# Altium schematic sheet mc33775.SchDoc
size A3; DocumentNumber: 2; SheetNumber: 2; SheetTotal: 11; SheetDescription: MC33775A BMS IC
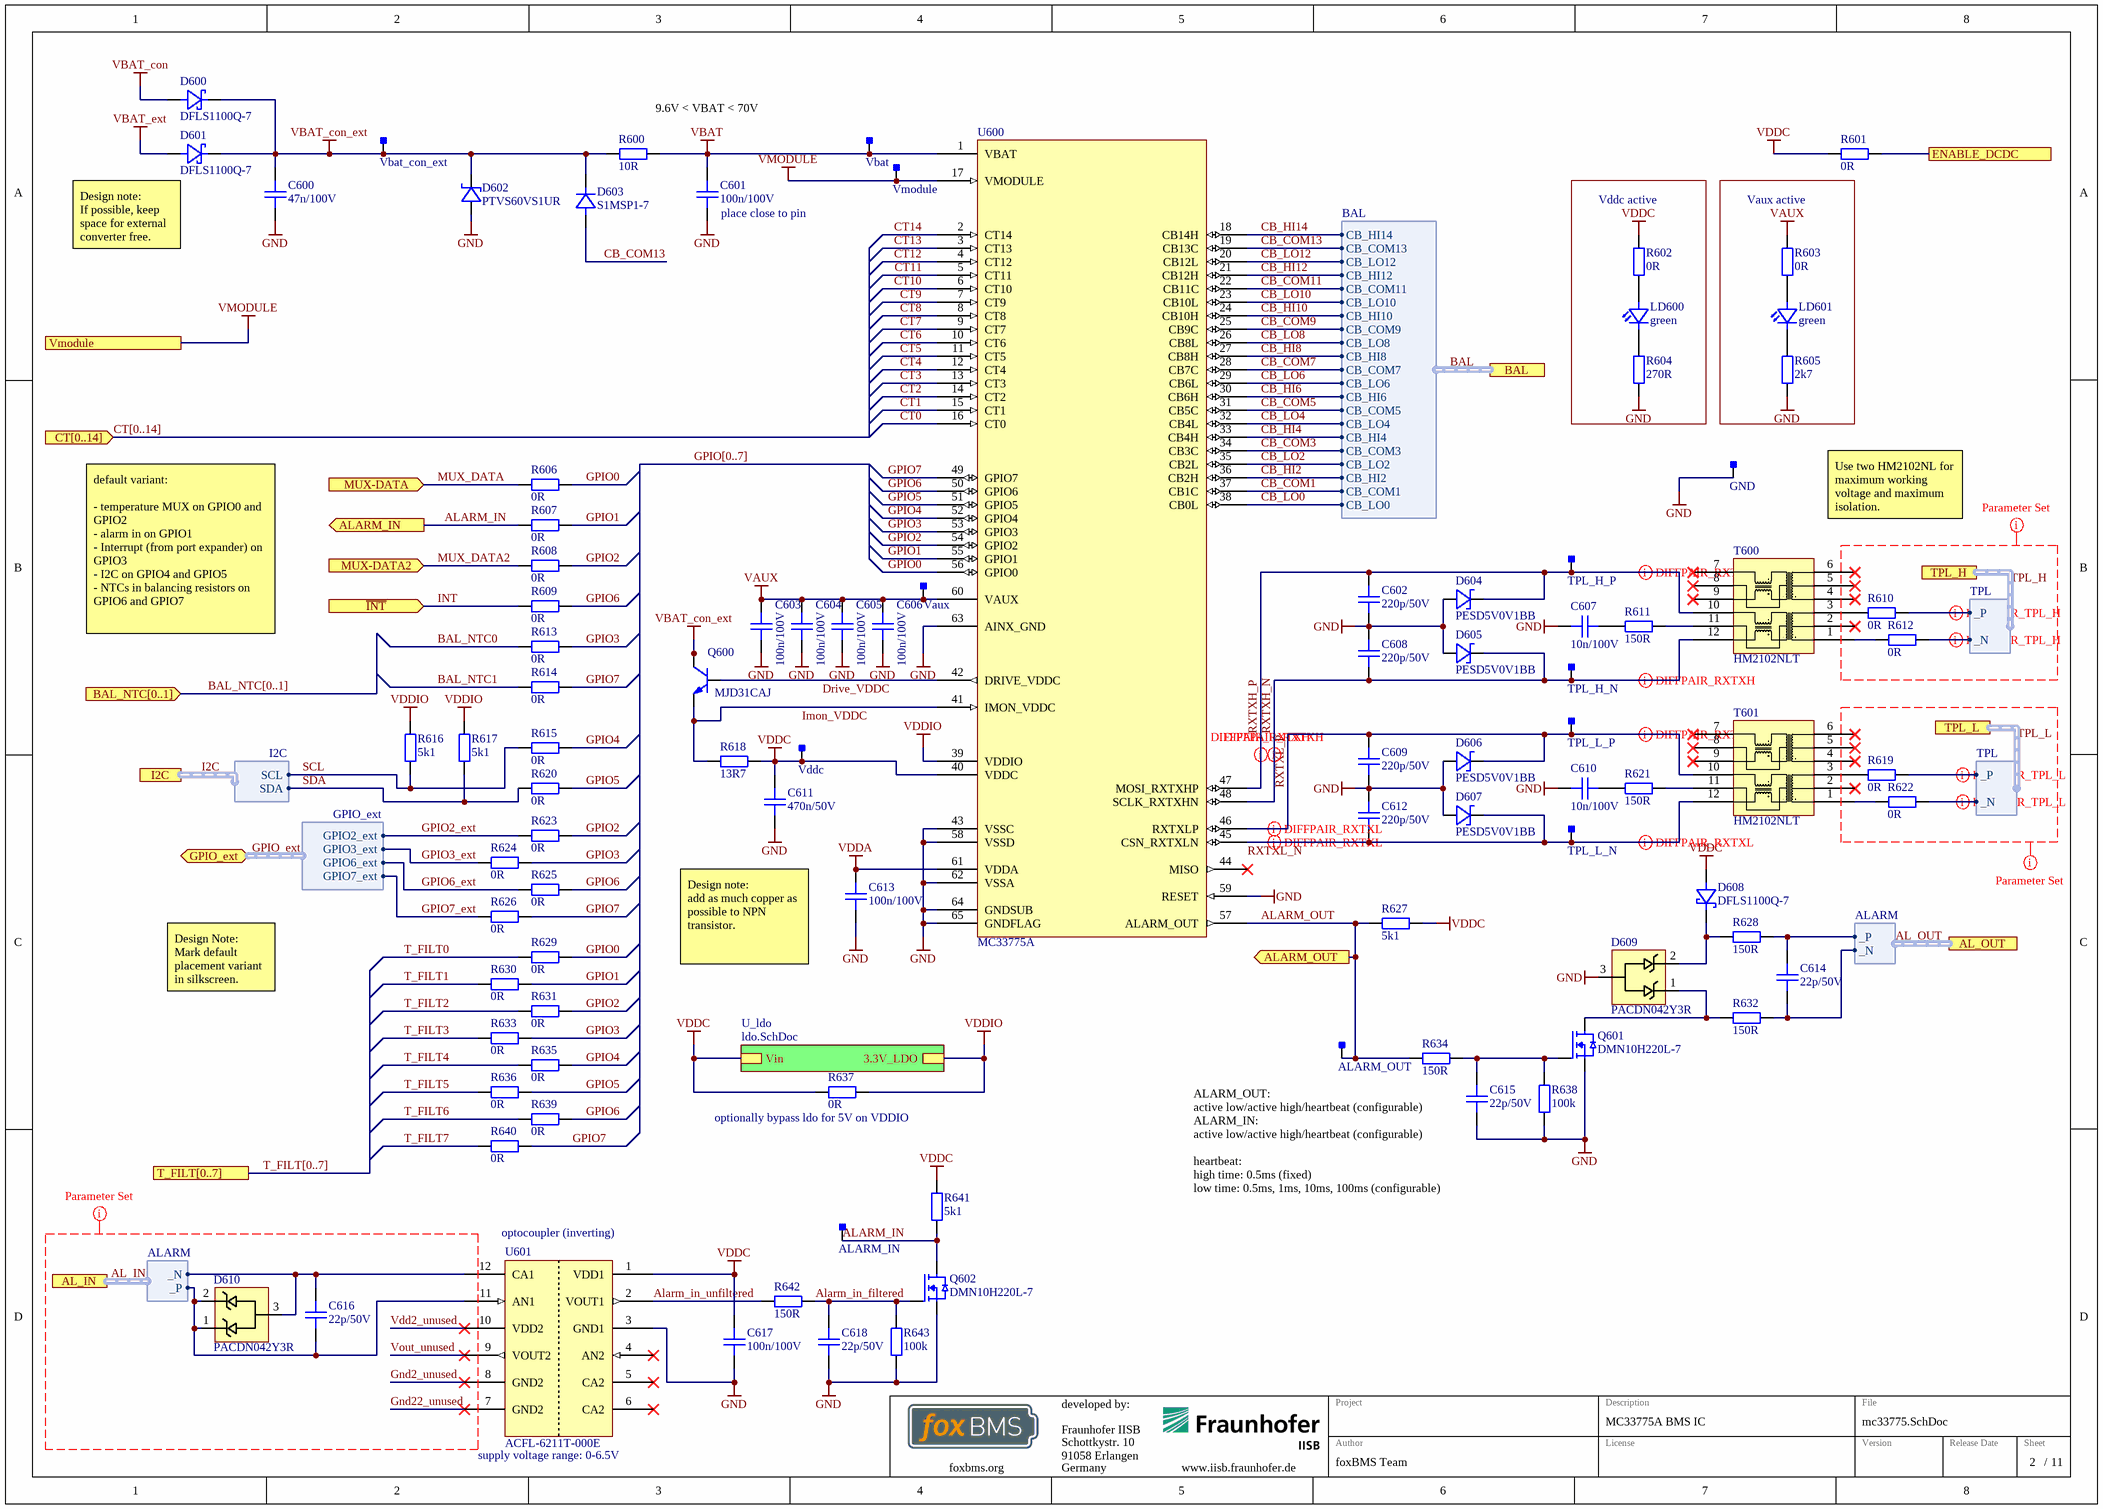
[diagram p0: mc33775.SchDoc]

## Parts
ALARM_IN  Testpoint_Square  [Testpoint_S1]  (value not drawn)  (no BOM)
ALARM_OUT  Testpoint_Square  [Testpoint_S1]  (value not drawn)  (no BOM)
C600  47n/100V  [CAPC1608X08N]
C601  100n/100V  [CAPC1608X08N]
C602  220p/50V  [CAPC1608X08N]
C603  100n/100V  [CAPC1608X08N]
C604  100n/100V  [CAPC1608X08N]
C605  100n/100V  [CAPC1608X08N]
C606  100n/100V  [CAPC1608X08N]
C607  10n/100V  [CAPC1608X08N]
C608  220p/50V  [CAPC1608X08N]
C609  220p/50V  [CAPC1608X08N]
C610  10n/100V  [CAPC1608X08N]
C611  470n/50V  [CAPC1608X08N]
C612  220p/50V  [CAPC1608X08N]
C613  100n/100V  [CAPC1608X08N]
C614  22p/50V  [CAPC1005X06N]
C615  22p/50V  [CAPC1005X06N]
C616  22p/50V  [CAPC1005X06N]
C617  100n/100V  [CAPC1608X08N]
C618  22p/50V  [CAPC1005X06N]
D600  DFLS1100Q-7  [PowerDI123]
D601  DFLS1100Q-7  [PowerDI123]
D602  PTVS60VS1UR  [NEXPERIA_PTVSxS1UR]
D603  S1MSP1-7  [S1MSP1]
D604  PESD5V0V1BB  [SOD523_PESD_NEXPERIA]
D605  PESD5V0V1BB  [SOD523_PESD_NEXPERIA]
D606  PESD5V0V1BB  [SOD523_PESD_NEXPERIA]
D607  PESD5V0V1BB  [SOD523_PESD_NEXPERIA]
D608  DFLS1100Q-7  [PowerDI123]
D609  PACDN042Y3R  [ON-SEMI-SOT-23-3-CASE-318-08]
D610  PACDN042Y3R  [ON-SEMI-SOT-23-3-CASE-318-08]
GND  Testpoint_Square  [Testpoint_S1]  (value not drawn)  (no BOM)
LD600  green  [LEDC1608X07N]
LD601  green  [LEDC1608X07N]
Q600  MJD31CAJ  [NEXPERIA_DPAK_SOT428C]
Q601  DMN10H220L-7  [SOT95P237X110-3N]
Q602  DMN10H220L-7  [SOT95P237X110-3N]
R600  10R  [RESC2012X05N]
R601  0R  [RESC1608X05N]
R602  0R  [RESC1608X05N]
R603  0R  [RESC1608X05N]
R604  270R  [RESC1608X05N]
R605  2k7  [RESC1608X05N]
R606  0R  [RESC1608X05N]
R607  0R  [RESC1608X05N]
R608  0R  [RESC1608X05N]
R609  0R  [RESC1608X05N]
R610  0R  [RESC1608X05N]
R611  150R  [RESC1608X05N]
R612  0R  [RESC1608X05N]
R613  0R  [RESC1608X05N]
R614  0R  [RESC1608X05N]
R615  0R  [RESC1608X05N]
R616  5k1  [RESC1608X05N]
R617  5k1  [RESC1608X05N]
R618  13R7  [RESC1608X05N]
R619  0R  [RESC1608X05N]
R620  0R  [RESC1608X05N]
R621  150R  [RESC1608X05N]
R622  0R  [RESC1608X05N]
R623  0R  [RESC1608X05N]
R624  0R  [RESC1608X05N]
R625  0R  [RESC1608X05N]
R626  0R  [RESC1608X05N]
R627  5k1  [RESC1608X05N]
R628  150R  [RESC1608X05N]
R629  0R  [RESC1608X05N]
R630  0R  [RESC1608X05N]
R631  0R  [RESC1608X05N]
R632  150R  [RESC1608X05N]
R633  0R  [RESC1608X05N]
R634  150R  [RESC1608X05N]
R635  0R  [RESC1608X05N]
R636  0R  [RESC1608X05N]
R637  0R  [RESC1608X05N]
R638  100k  [RESC1608X05N]
R639  0R  [RESC1608X05N]
R640  0R  [RESC1608X05N]
R641  5k1  [RESC1608X05N]
R642  150R  [RESC1608X05N]
R643  100k  [RESC1608X05N]
T600  HM2102NLT  [HM2102NL]
T601  HM2102NLT  [HM2102NL]
TPL_H_N  Testpoint_Square  [Testpoint_S1]  (value not drawn)  (no BOM)
TPL_H_P  Testpoint_Square  [Testpoint_S1]  (value not drawn)  (no BOM)
TPL_L_N  Testpoint_Square  [Testpoint_S1]  (value not drawn)  (no BOM)
TPL_L_P  Testpoint_Square  [Testpoint_S1]  (value not drawn)  (no BOM)
U600  MC33775A  [NXP_SOT1510-2]
U601  ACFL-6211T-000E  [Broadcom_ACFL-6211T]
Vaux  Testpoint_Square  [Testpoint_S1]  (value not drawn)  (no BOM)
Vbat  Testpoint_Square  [Testpoint_S1]  (value not drawn)  (no BOM)
Vbat_con_ext  Testpoint_Square  [Testpoint_S1]  (value not drawn)  (no BOM)
Vddc  Testpoint_Square  [Testpoint_S1]  (value not drawn)  (no BOM)
Vmodule  Testpoint_Square  [Testpoint_S1]  (value not drawn)  (no BOM)

## Blocks framed on the sheet
Vddc active: LD600 R602 R604
Vaux active: LD601 R603 R605

## Sub-sheets
U_ldo = ldo.SchDoc: 3.3V_LDO, Vin

## Ports
AL_IN (harness ALARM), AL_OUT (harness ALARM), ALARM_IN (out), ALARM_OUT (out), BAL (harness BAL), BAL_NTC[0..1] (in), CT[0..14] (in), ENABLE_DCDC, GPIO_ext (bidir, harness GPIO_ext), I2C (harness I2C), MUX-DATA2 (in), MUX-DATA (in), T_FILT[0..7], TPL_H (harness TPL), TPL_L (harness TPL), Vmodule, ~{INT} (in)

## Harnesses
BAL: CB_HI14, CB_COM13, CB_LO12, CB_HI12, CB_COM11, CB_LO10, CB_HI10, CB_COM9, CB_LO8, CB_HI8, CB_COM7, CB_LO6, CB_HI6, CB_COM5, CB_LO4, CB_HI4, CB_COM3, CB_LO2, CB_HI2, CB_COM1, CB_LO0
TPL: _P, _N
ALARM: _P, _N
I2C: SCL, SDA
GPIO_ext: GPIO3_ext, GPIO2_ext, GPIO6_ext, GPIO7_ext

## Nets
GND: C600.1 C601.1 C602.1 C603.1 C604.1 C605.1 C606.1 C607.1 C608.2 C609.1 C610.1 C611.1 C612.2 C613.1 C615.1 C617.1 C618.1 D602.2(A) D604.2(A) D605.2(A) D606.2(A) D607.2(A) D609.3 GND.1 Q601.S Q602.S R604.1 R605.1 R638.2 R643.2 U600.43(VSSC) U600.58(VSSD) U600.59(RESET) U600.62(VSSA) U600.63(AINX_GND) U600.64(GNDSUB) U600.65(GNDFLAG) U601.3(GND1)
VAUX: C603.2 C604.2 C605.2 C606.2 R603.2 U600.60(VAUX) Vaux.1
VBAT: C601.2 R600.1 U600.1(VBAT) Vbat.1
VBAT_con: D600.2(A)
VBAT_con_ext: C600.2 D600.1(K) D601.1(K) D602.1(C) D603.1(K) Q600.2(C) Q600.4(C) R600.2 Vbat_con_ext.1
VBAT_ext: D601.2(A)
VDDA: C613.2 U600.61(VDDA)
VDDC: C611.2 C617.2 D608.2(A) R601.1 R602.2 R618.1 R627.1 R637.2 R641.1 U600.40(VDDC) U601.1(VDD1) Vddc.1 ; sheet U_ldo/Vin
VDDIO: R616.2 R617.2 R637.1 U600.39(VDDIO) ; sheet U_ldo/3.3V_LDO
VMODULE: U600.17(VMODULE) Vmodule.1 ; port Vmodule
AL_IN._N: C616.2 D610.3 U601.12(CA1) ; port AL_IN._N
AL_IN._P: C616.1 D610.1 D610.2 U601.11(AN1) ; port AL_IN._P
AL_OUT._N: C614.1 R632.2 ; port AL_OUT._N
AL_OUT._P: C614.2 R628.2 ; port AL_OUT._P
ALARM_IN: ALARM_IN.1 Q602.D R607.1 R641.2 ; port ALARM_IN
Alarm_in_filtered: C618.2 Q602.G R642.2 R643.1
Alarm_in_unfiltered: R642.1 U601.2(VOUT1)
ALARM_OUT: ALARM_OUT.1 R627.2 R634.1 U600.57(ALARM_OUT) ; port ALARM_OUT
BAL_NTC0: R613.1
BAL_NTC1: R614.1
CB_COM1: U600.37(CB1C) ; port BAL.CB_COM1  [project net BAL.CB_COM1]
CB_COM3: U600.34(CB3C) ; port BAL.CB_COM3  [project net BAL.CB_COM3]
CB_COM5: U600.31(CB5C) ; port BAL.CB_COM5  [project net BAL.CB_COM5]
CB_COM7: U600.28(CB7C) ; port BAL.CB_COM7  [project net BAL.CB_COM7]
CB_COM9: U600.25(CB9C) ; port BAL.CB_COM9  [project net BAL.CB_COM9]
CB_COM11: U600.22(CB11C) ; port BAL.CB_COM11  [project net BAL.CB_COM11]
CB_COM13: D603.2(A) U600.19(CB13C) ; port BAL.CB_COM13  [project net BAL.CB_COM13]
CB_HI2: U600.36(CB2H) ; port BAL.CB_HI2  [project net BAL.CB_HI2]
CB_HI4: U600.33(CB4H) ; port BAL.CB_HI4  [project net BAL.CB_HI4]
CB_HI6: U600.30(CB6H) ; port BAL.CB_HI6  [project net BAL.CB_HI6]
CB_HI8: U600.27(CB8H) ; port BAL.CB_HI8  [project net BAL.CB_HI8]
CB_HI10: U600.24(CB10H) ; port BAL.CB_HI10  [project net BAL.CB_HI10]
CB_HI12: U600.21(CB12H) ; port BAL.CB_HI12  [project net BAL.CB_HI12]
CB_HI14: U600.18(CB14H) ; port BAL.CB_HI14  [project net BAL.CB_HI14]
CB_LO0: U600.38(CB0L) ; port BAL.CB_LO0  [project net BAL.CB_LO0]
CB_LO2: U600.35(CB2L) ; port BAL.CB_LO2  [project net BAL.CB_LO2]
CB_LO4: U600.32(CB4L) ; port BAL.CB_LO4  [project net BAL.CB_LO4]
CB_LO6: U600.29(CB6L) ; port BAL.CB_LO6  [project net BAL.CB_LO6]
CB_LO8: U600.26(CB8L) ; port BAL.CB_LO8  [project net BAL.CB_LO8]
CB_LO10: U600.23(CB10L) ; port BAL.CB_LO10  [project net BAL.CB_LO10]
CB_LO12: U600.20(CB12L) ; port BAL.CB_LO12  [project net BAL.CB_LO12]
CT0: U600.16(CT0)
CT1: U600.15(CT1)
CT2: U600.14(CT2)
CT3: U600.13(CT3)
CT4: U600.12(CT4)
CT5: U600.11(CT5)
CT6: U600.10(CT6)
CT7: U600.9(CT7)
CT8: U600.8(CT8)
CT9: U600.7(CT9)
CT10: U600.6(CT10)
CT11: U600.5(CT11)
CT12: U600.4(CT12)
CT13: U600.3(CT13)
CT14: U600.2(CT14)
Drive_VDDC: Q600.1(B) U600.42(DRIVE_VDDC)
ENABLE_DCDC: R601.2 ; port ENABLE_DCDC
Gnd2_unused: U601.8(GND2)
Gnd22_unused: U601.7(GND2)
GPIO0: R606.2 R629.2 U600.56(GPIO0)
GPIO1: R607.2 R630.2 U600.55(GPIO1)
GPIO2: R608.2 R623.2 R631.2 U600.54(GPIO2)
GPIO2_ext: R623.1 ; port GPIO_ext.GPIO2_ext
GPIO3: R613.2 R624.2 R633.2 U600.53(GPIO3)
GPIO3_ext: R624.1 ; port GPIO_ext.GPIO3_ext
GPIO4: R615.2 R635.2 U600.52(GPIO4)
GPIO5: R620.2 R636.2 U600.51(GPIO5)
GPIO6: R609.2 R625.2 R639.2 U600.50(GPIO6)
GPIO6_ext: R625.1 ; port GPIO_ext.GPIO6_ext
GPIO7: R614.2 R626.2 R640.2 U600.49(GPIO7)
GPIO7_ext: R626.1 ; port GPIO_ext.GPIO7_ext
Imon_VDDC: Q600.3(E) R618.2 U600.41(IMON_VDDC)
INT: R609.1 ; port ~{INT}
MUX_DATA: R606.1 ; port MUX-DATA
MUX_DATA2: R608.1 ; port MUX-DATA2
RXTXH_N: C608.1 D605.1(C) T600.12 TPL_H_N.1 U600.48(SCLK_RXTXHN)
RXTXH_P: C602.2 D604.1(C) T600.10 TPL_H_P.1 U600.47(MOSI_RXTXHP)
RXTXL_N: C612.1 D607.1(C) T601.12 TPL_L_N.1 U600.45(CSN_RXTXLN)
RXTXL_P: C609.2 D606.1(C) T601.10 TPL_L_P.1 U600.46(RXTXLP)
SCL: R615.1 R616.1 ; port I2C.SCL  [project net I2C.SCL]
SDA: R617.1 R620.1 ; port I2C.SDA  [project net I2C.SDA]
T_FILT0: R629.1
T_FILT1: R630.1
T_FILT2: R631.1
T_FILT3: R633.1
T_FILT4: R635.1
T_FILT5: R636.1
T_FILT6: R639.1
T_FILT7: R640.1
TPL_H._N: R612.2 ; port TPL_H._N
TPL_H._P: R610.2 ; port TPL_H._P
TPL_L._N: R622.2 ; port TPL_L._N
TPL_L._P: R619.2 ; port TPL_L._P
Vdd2_unused: U601.10(VDD2)
Vout_unused: U601.9(VOUT2)
NetC607_2: C607.2 R611.1
NetC610_2: C610.2 R621.1
NetC615_2: C615.2 Q601.G R634.2 R638.1
NetD608_1: D608.1(K) D609.2 R628.1
NetD609_1: D609.1 Q601.D R632.1
NetLD600_1: LD600.1(C) R604.2
NetLD600_2: LD600.2(A) R602.1
NetLD601_1: LD601.1(C) R605.2
NetLD601_2: LD601.2(A) R603.1
NetR610_1: R610.1 T600.3
NetR611_2: R611.2 T600.11
NetR612_1: R612.1 T600.1
NetR619_1: R619.1 T601.3
NetR621_2: R621.2 T601.11
NetR622_1: R622.1 T601.1

Not connected (* = marked no-connect by the designer): T600 2* 4* 5* 6* 7* 8* 9*; T601 2* 4* 5* 6* 7* 8* 9*; U600 44(MISO)*; U601 4(AN2)* 5(CA2)* 6(CA2)*

## Buses and harness runs
bus BAL_NTC[0..1] = port BAL_NTC[0..1]
bus CT[0..14] = port CT[0..14]
bus GPIO[0..7]
bus T_FILT[0..7] = port T_FILT[0..7]
harness AL_IN = port AL_IN
harness AL_OUT = port AL_OUT
harness BAL = port BAL
harness GPIO_ext = port GPIO_ext
harness I2C = port I2C
harness TPL_H = port TPL_H
harness TPL_L = port TPL_L

## Layout directives
differential pair: RXTXH_N, RXTXH_P, RXTXL_N, RXTXL_P, TPL_L._N, TPL_L._P
differential pair; differential pair class TPL_H: TPL_H._N, TPL_H._P
net class TPL_high: TPL_H
net class TPL_low: TPL_L
net class ALARM_in: AL_IN, Gnd2_unused, Gnd22_unused, Vdd2_unused, Vout_unused

## Notes on the sheet
- (near R600) 9.6V < VBAT < 70V
- (near D601) Design note:
  If possible, keep space for external converter free.
- (near C601) place close to pin
- Use two HM2102NL for maximum working voltage and maximum isolation.
- default variant:
  - temperature MUX on GPIO0 and GPIO2
  - alarm in on GPIO1
  - Interrupt (from port expander) on GPIO3
  - I2C on GPIO4 and GPIO5
  - NTCs in balancing resistors on GPIO6 and GPIO7
- Design Note:
  Mark default placement variant in silkscreen.
- Design note:
  add as much copper as possible to NPN transistor.
- (near R637) optionally bypass ldo for 5V on VDDIO
- ALARM_OUT:
  active low/active high/heartbeat (configurable)
  ALARM_IN:
  active low/active high/heartbeat (configurable)
  heartbeat:
  high time: 0.5ms (fixed)
  low time: 0.5ms, 1ms, 10ms, 100ms (configurable)
- (near U601) optocoupler (inverting)
- (near U601) supply voltage range: 0-6.5V
- Fraunhofer IISB
- Schottkystr. 10
- developed by:
- 91058 Erlangen
- Germany
- Author
- Project
- License
- Description
- File
- Version
- Release Date
- Sheet
- foxbms.org <https://foxbms.org>
- www.iisb.fraunhofer.de <https://www.iisb.fraunhofer.de/>
- foxBMS Team
- /

## Library data of the parts
ALARM_IN ALARM_OUT GND TPL_H_N TPL_H_P TPL_L_N TPL_L_P Vaux Vbat Vbat_con_ext Vddc Vmodule = Testpoint_Square: Testpoint, square; Automotive Qualified: False; Part Number: Testpoint_Square
C600 = gen_C_ceramic_47n_100V_X7R_0603: MLCC; Capacitance: 47n; Rated Voltage: 100V; Dielectric: X7R; Case EIA: 0603; Case Metric: 1608; Automotive Qualified: True; PnP Package: 0603C; Part Number: gen_C_ceramic_47n_100V_X7R_0603; Supplier 1: Farnell; Supplier Part Number 1: 2478249; Supplier 2: Farnell; Supplier Part Number 2: 2708699; Supplier 3: Farnell; Supplier Part Number 3: 2905110
C601 C603-C606 C613 C617 = gen_C_ceramic_100n_100V_X7R_0603: MLCC; Capacitance: 100n; Rated Voltage: 100V; Dielectric: X7R; Case EIA: 0603; Case Metric: 1608; Automotive Qualified: True; PnP Package: 0603C; Part Number: gen_C_ceramic_100n_100V_X7R_0603; Supplier 1: Digikey; Supplier Part Number 1: 490-13420-1-ND; Supplier 2: Mouser; Supplier Part Number 2: 81-GCJ188R72A104KA1D
C602 C608 C609 C612 = gen_C_ceramic_220p_50V_C0G_0603: MLCC; Capacitance: 220p; Rated Voltage: 50V; Dielectric: C0G; Case EIA: 0603; Case Metric: 1608; Automotive Qualified: True; AEC-Q Norm: AEC-Q200; PnP Package: 0603C; Part Number: gen_C_ceramic_220p_50V_C0G_0603; Supplier 1: Mouser; Supplier Part Number 1: 603-AC603JRNPO9BN221; ECCN: EAR99
C607 C610 = gen_C_ceramic_10n_100V_X7R_0603: MLCC; Capacitance: 10n; Rated Voltage: 100V; Dielectric: X7R; Case EIA: 0603; Case Metric: 1608; PnP Package: 0603C; PnP Value: 10nF/100V/X7R; Automotive Qualified: True; AEC-Q Norm: AEC-Q200; Part Number: gen_C_ceramic_10n_100V_X7R_0603; Supplier 1: Farnell; Supplier Part Number 1: 1301715; Supplier 2: Farnell; Supplier Part Number 2: 2821192; Supplier 3: Farnell; Supplier Part Number 3: 2210878; ECCN: EAR99
C611 = gen_C_ceramic_470n_50V_X7R_0603: MLCC; Capacitance: 470n; Rated Voltage: 50V; Dielectric: X7R; Case EIA: 0603; Case Metric: 1608; Automotive Qualified: True; AEC-Q Norm: AEC-Q200; PnP Package: 0603C; Part Number: gen_C_ceramic_470n_50V_X7R_0603; Supplier 1: Farnell; Supplier Part Number 1: 2547051; ECCN: EAR99
C614-C616 C618 = gen_C_ceramic_22p_50V_C0G_0402: MLCC; Capacitance: 22p; Rated Voltage: 50V; Dielectric: C0G; Case EIA: 0402; Case Metric: 1005; PnP Package: 0402C; Automotive Qualified: True; Tolerance: 1%; Part Number: gen_C_ceramic_22p_50V_C0G_0402; Supplier 1: Farnell; Supplier Part Number 1: 1856067
D600 D601 D608 = DFLS1100Q-7: Schottky Diode; Manufacturer: Diodes Inc.; Breakdown Voltage: 100V; Continuous Forward Current: 1A; Automotive Qualified: True; Part Number: DFLS1100Q-7; Part Name: DFLS1100Q-7; Operating Temperature: −55°C - +175°C; ComponentLink1Description: Datasheet; ComponentLink1URL: https://www.diodes.com/assets/Datasheets/ds30497.pdf; Supplier 1: Mouser; Supplier Part Number 1: 621-DFLS1-100Q-7; Supplier 2: Digikey; Supplier Part Number 2: DFLS1100Q-7DICT-ND; Supplier 3: Farnell; Supplier Part Number 3: 3127293; PnP Package: POWERDI123
D602 = PTVS60VS1UR: 400W Transient Voltage Suppressor; Part Name: PTVSxS1UR; Manufacturer: Nexperia; Breakdown Voltage: 70.20V; Automotive Qualified: True; AEC-Q Norm: AEC-Q101; Part Number: PTVS60VS1UR; Operating Temperature: -55°C - +150°C; Continuous Forward Current: *; ComponentLink1Description: Datasheet; ComponentLink1URL: https://assets.nexperia.com/documents/data-sheet/PTVSXS1UR_SER.pdf; Supplier 1: Mouser; Supplier Part Number 1: 771-PTVS60VS1UR115; Supplier 2: Digikey; Supplier Part Number 2: 1727-5879-1-ND; ECCN: EAR99
D603 = S1MSP1-7: 1.0A surface mount glass passivated rectifier; Manufacturer: Diodes Inc.; Breakdown Voltage: 1000V; Continuous Forward Current: 1A; Automotive Qualified: False; Part Number: S1MSP1-7; Part Name: S1MSP1-7; Operating Temperature: -55°C - +150°C; ComponentLink1Description: Datasheet; ComponentLink1URL: https://www.mouser.de/datasheet/2/115/S1MSP1-1019698.pdf; Supplier 1: Mouser; Supplier Part Number 1: 621-S1MSP1-7; Supplier 2: Digikey; Supplier Part Number 2: S1MSP1-7-ND; ECCN: EAR99
D604-D607 = PESD5V0V1BB: Very low capacitance bidirectional ESD protection diode; Manufacturer: Nexperia; Breakdown Voltage: 6.8V; PnP Package: SOD523; Automotive Qualified: True; AEC-Q Norm: AEC-Q101; Part Number: PESD5V0V1BB; Part Name: PESD5V0V1BB; Operating Temperature: -55°C - +150°C; Continuous Forward Current: *; ComponentLink1Description: Datasheet; ComponentLink1URL: https://assets.nexperia.com/documents/data-sheet/PESD5V0V1BB.pdf; Supplier 1: Mouser; Supplier Part Number 1: 771-PESD5V0V1BB115; Supplier 2: Digikey; Supplier Part Number 2: 1727-5808-1-ND; Supplier 3: Farnell; Supplier Part Number 3: 2069367; ECCN: EAR99
D609 D610 = PACDN042Y3R: ESD-Schutzbaustein; Manufacturer: ON Semiconductor; Breakdown Voltage: 8V; PnP Package: SOT23-3; Automotive Qualified: True; Part Number: PACDN042Y3R; Part Name: PACDN042Y3R; ComponentLink1Description: Datasheet; ComponentLink1URL: http://www.farnell.com/datasheets/2354265.pdf; Supplier 1: Farnell; Supplier Part Number 1: 2317483; Supplier 2: Digikey; Supplier Part Number 2: PACDN042Y3ROSCT-ND; Supplier 3: Mouser; Supplier Part Number 3: 748-PACDN042Y3R
LD600 LD601 = LED_0603_green_AECQ: TLMG1100-GS08; Manufacturer: Vishay; Breakdown Voltage: 5V; Continuous Forward Current: 20mA; Forward Voltage @ 20mA: 2.1V; Automotive Qualified: True; Part Number: LED_0603_green_AECQ; Color: green; Supplier 1: Farnell; Supplier Part Number 1: 2293494; PnP Package: LED_0603; Operating Temperature: -40°C - 100°C; ComponentLink1Description: Datasheet; ComponentLink1URL: http://www.farnell.com/datasheets/2049164.pdf; Supplier 2: Digikey; Supplier Part Number 2: 751-1165-1-ND
Q600 = MJD31CAJ: 100V, 3A NPN high power bipolar transistor; Manufacturer: Nexperia; Automotive Qualified: True; AEC-Q Norm: AEC-Q101; Part Number: MJD31CAJ; Part Name: MJD31CA; Operating Temperature: -55°C - +150°C; Maximum Drain-Source Voltage: *; Maximum Continous Drain Current (25°C): *; ComponentLink1Description: Datasheet; ComponentLink1URL: https://www.mouser.de/datasheet/2/916/MJD31CA-1665957.pdf; Supplier 1: Mouser; Supplier Part Number 1: 771-MJD31CAJ; R_DS(on): *; Total Gate Charge: *; Supplier 2: Digikey; Supplier Part Number 2: 1727-8685-1-ND; ECCN: EAR99
Q601 Q602 = DMN10H220L-7: MOSFET-Transistor, n-Kanal, 1.6 A, 100 V, 0.250 ohm; Manufacturer: Diodes; Maximum Drain-Source Voltage: 100V; Maximum Continous Drain Current (25°C): 1.6A; R_DS(on): 250m; Total Gate Charge: 4.1nC; Automotive Qualified: True; Part Number: DMN10H220L-7; Part Name: NMOS; Operating Temperature: -55°C - +150°C; ComponentLink1Description: Datasheet; ComponentLink1URL: https://www.diodes.com/assets/Datasheets/DMN10H220L.pdf; Supplier 1: Digikey; Supplier Part Number 1: DMN10H220L-7DICT-ND
R600 = gen_R_10R_0805: SMD Resistor 10R 0805; Tolerance: 1%; Power: 0.125W; Case EIA: 0805; Case Metric: 2012; Maximum Working Voltage: 150V; PnP Package: 0805R; Automotive Qualified: True; AEC-Q Norm: AEC-Q200; AEC-Q Grade: Grade 0; Part Number: gen_R_10R_0805; Operating Temperature: -55°C - +155°C; Resistance: 10R; Series: E24, E96; PnP Value: 10R; Supplier 1: Farnell; Supplier Part Number 1: 1750728; ECCN: EAR99
R601-R603 R606-R610 R612-R615 R619 R620 R622-R626 R629-R631 R633 R635-R637 R639 R640 = gen_R_0R_0603: SMD Resistor 0R 0603; Power: 0.1W; Case EIA: 0603; Case Metric: 1608; Maximum Working Voltage: 75V; PnP Package: 0603R; Automotive Qualified: True; PnP equipped: x; Part Number: gen_R_0R_0603; Operating Temperature: -55°C - +155°C; Resistance: 0R; Series: Jumper; PnP Value: 0R; Supplier 1: Farnell; Supplier Part Number 1: 2616580
R604 = gen_R_270R_0603: SMD Resistor 270R 0603; Tolerance: 1%; Power: 0.1W; Case EIA: 0603; Case Metric: 1608; Maximum Working Voltage: 75V; PnP Package: 0603R; Automotive Qualified: True; Part Number: gen_R_270R_0603; Operating Temperature: -55°C - +155°C; Resistance: 270R; Series: E24; PnP Value: 270R; Supplier 1: Farnell; Supplier Part Number 1: 2141320
R605 = gen_R_2k7_0603: SMD Resistor 2k7 0603; Tolerance: 1%; Power: 0.1W; Case EIA: 0603; Case Metric: 1608; Maximum Working Voltage: 75V; PnP Package: 0603R; Automotive Qualified: False; Part Number: gen_R_2k7_0603; Operating Temperature: -55°C - +155°C; Resistance: 2k7; Series: E24; PnP Value: 2k7
R611 R621 R628 R632 R634 R642 = gen_R_150R_0603: SMD Resistor 150R 0603; Tolerance: 1%; Power: 0.1W; Case EIA: 0603; Case Metric: 1608; Maximum Working Voltage: 75V; PnP Package: 0603R; Automotive Qualified: True; AEC-Q Grade: Grade 0; AEC-Q Norm: AEC-Q200; Part Number: gen_R_150R_0603; Operating Temperature: -55°C - +155°C; Resistance: 150R; Series: E24, E96; PnP Value: 150R; ECCN: EAR99; Supplier 1: Farnell; Supplier Part Number 1: 2303076
R616 R617 R627 R641 = gen_R_5k1_0603: SMD Resistor 5k1 0603; Tolerance: 5%; Power: 0.1W; Case EIA: 0603; Case Metric: 1608; Maximum Working Voltage: 75V; PnP Package: 0603R; Automotive Qualified: True; AEC-Q Norm: AEC-Q200; Part Number: gen_R_5k1_0603; Operating Temperature: -55°C - +155°C; Resistance: 5k1; Series: E24; PnP Value: 5k1; Supplier 1: Mouser; Supplier Part Number 1: 667-ERJ-3GEYJ512V; ECCN: EAR99
R618 = gen_R_13R7_0603: SMD Resistor 13R7 0603; Tolerance: 1%; Power: 0.1W; Case EIA: 0603; Case Metric: 1608; Maximum Working Voltage: 75V; PnP Package: 0603R; Automotive Qualified: False; Part Number: gen_R_13R7_0603; Operating Temperature: -55°C - +155°C; Resistance: 13R7; Series: E96; PnP Value: 13R7
R638 R643 = gen_R_100k_0603: SMD Resistor 100k 0603; Tolerance: 1%; Power: 0.1W; Case EIA: 0603; Case Metric: 1608; Maximum Working Voltage: 75V; PnP Package: 0603R; Automotive Qualified: True; PnP equipped: x; Part Number: gen_R_100k_0603; Operating Temperature: -55°C - +155°C; Resistance: 100k; Series: E24, E96; PnP Value: 100k; Supplier 1: Farnell; Supplier Part Number 1: 2303232
T600 T601 = HM2102NLT: Pulse HM2102NLT BMS Transformer; Automotive Qualified: True; AEC-Q Norm: AEC-Q200; Part Number: HM2102NLT; Manufacturer: Pulse; Operating Temperature: -40°C - +125°C; ComponentLink1Description: Datasheet; ComponentLink1URL: https://www.mouser.de/datasheet/2/336/HM2102NL-1218600.pdf; ECCN: EAR99; Supplier 1: Mouser; Supplier Part Number 1: 673-HM2102NLT; Supplier 2: Digikey; Supplier Part Number 2: 1840-1034-1-ND
U600 = MC33775A: 14 Cells Battery Cell Controller IC; Manufacturer: NXP; Automotive Qualified: True; AEC-Q Norm: AEC-Q100; AEC-Q Grade: Grade 1; Part Number: MC33775A; Part Name: MC33775A; Operating Temperature: −40°C - +125°C
U601 = ACFL-6211T-000E: 15MBd Dual-channel Bi-directional Optocoupler; Manufacturer: Broadcom; PnP Package: 12-BSOP; Automotive Qualified: True; AEC-Q Norm: AEC-Q100; AEC-Q Grade: Grade 1; Part Number: ACFL-6211T-000E; Part Name: ACFL-6211T-000E; Operating Temperature: -40°C - +125°C; ComponentLink1Description: Datasheet; ComponentLink1URL: https://docs.broadcom.com/docs/AV02-4835EN; Supplier 1: Digikey; Supplier Part Number 1: 516-3808-ND; Supplier 2: Mouser; Supplier Part Number 2: 630-ACFL6211T000E; ECCN: EAR99